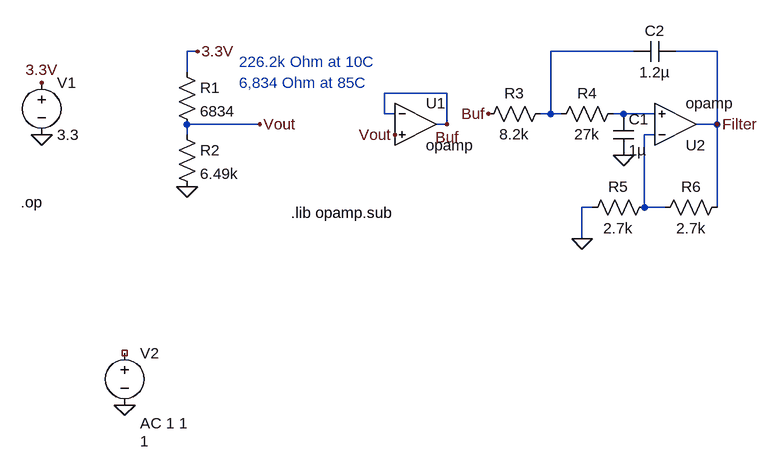
[diagram p0: schematic ThermistorSim.asc]
ThermistorSim.asc, the LTspice schematic file:
Version 4
SHEET 1 1016 680
WIRE 160 32 144 32
WIRE 832 32 704 32
WIRE 960 32 896 32
WIRE 144 64 144 32
WIRE 544 96 448 96
WIRE 448 128 448 96
WIRE 464 128 448 128
WIRE 704 128 704 32
WIRE 704 128 688 128
WIRE 720 128 704 128
WIRE 816 128 800 128
WIRE 864 128 816 128
WIRE 256 144 144 144
WIRE 544 144 544 96
WIRE 544 144 528 144
WIRE 960 144 960 32
WIRE 960 144 928 144
WIRE 144 160 144 144
WIRE 864 160 848 160
WIRE 768 272 752 272
WIRE 848 272 848 160
WIRE 880 272 848 272
WIRE 960 272 960 144
WIRE 752 320 752 272
FLAG 160 32 3.3V
FLAG 144 240 0
FLAG 256 144 Vout
FLAG -80 160 0
FLAG -80 80 3.3V
FLAG 464 160 Vout
FLAG 544 144 Buf
FLAG 816 192 0
FLAG 752 320 0
FLAG 960 144 Filter
FLAG 48 576 0
FLAG 608 128 Buf
SYMBOL res 128 48 R0
SYMATTR InstName R1
SYMATTR Value 6834
SYMATTR SpiceLine tol=1 pwr=100m
SYMBOL res 128 144 R0
SYMATTR InstName R2
SYMATTR Value 6.49k
SYMBOL voltage -80 64 R0
WINDOW 123 0 0 Left 0
WINDOW 39 0 0 Left 0
SYMATTR InstName V1
SYMATTR Value 3.3
SYMBOL OpAmps\\opamp 496 80 R0
SYMATTR InstName U1
SYMBOL OpAmps\\opamp 896 208 M180
SYMATTR InstName U2
SYMBOL res 704 112 R90
WINDOW 0 0 56 VBottom 2
WINDOW 3 32 56 VTop 2
SYMATTR InstName R3
SYMATTR Value 8.2k
SYMBOL res 816 112 R90
WINDOW 0 0 56 VBottom 2
WINDOW 3 32 56 VTop 2
SYMATTR InstName R4
SYMATTR Value 27k
SYMBOL cap 800 128 R0
SYMATTR InstName C1
SYMATTR Value 1µ
SYMBOL cap 896 16 R90
WINDOW 0 0 32 VBottom 2
WINDOW 3 32 32 VTop 2
SYMATTR InstName C2
SYMATTR Value 1.2µ
SYMBOL res 864 256 R90
WINDOW 0 0 56 VBottom 2
WINDOW 3 32 56 VTop 2
SYMATTR InstName R5
SYMATTR Value 2.7k
SYMBOL res 976 256 R90
WINDOW 0 0 56 VBottom 2
WINDOW 3 32 56 VTop 2
SYMATTR InstName R6
SYMATTR Value 2.7k
SYMBOL voltage 48 480 R0
WINDOW 3 24 152 Left 2
WINDOW 123 24 124 Left 2
WINDOW 39 0 0 Left 0
SYMATTR Value 1
SYMATTR Value2 AC 1 1
SYMATTR InstName V2
TEXT 224 48 Left 2 ;226.2k Ohm at 10C
TEXT 224 80 Left 2 ;6,834 Ohm at 85C
TEXT -112 264 Left 2 !.op
TEXT 304 280 Left 2 !.lib opamp.sub

The netlist it stands for:
* ThermistorSim.asc
R1 3.3V Vout 6834 tol=1 pwr=100m
R2 Vout 0 6.49k
V1 3.3V 0 3.3
XU1 Buf Vout Buf opamp Aol=100K GBW=10Meg  ; pins invin noninvin out
XU2 N003 N002 Filter opamp Aol=100K GBW=10Meg  ; pins invin noninvin out
R3 N001 Buf 8.2k
R4 N002 N001 27k
C1 N002 0 1µ
C2 Filter N001 1.2µ
R5 N003 0 2.7k
R6 Filter N003 2.7k
V2 NC_01 0 1 AC 1 1
* 226.2k Ohm at 10C
* 6,834 Ohm at 85C
.op
.lib opamp.sub
.backanno
.end